# Altium project Generador_de_funciones.PrjPcb
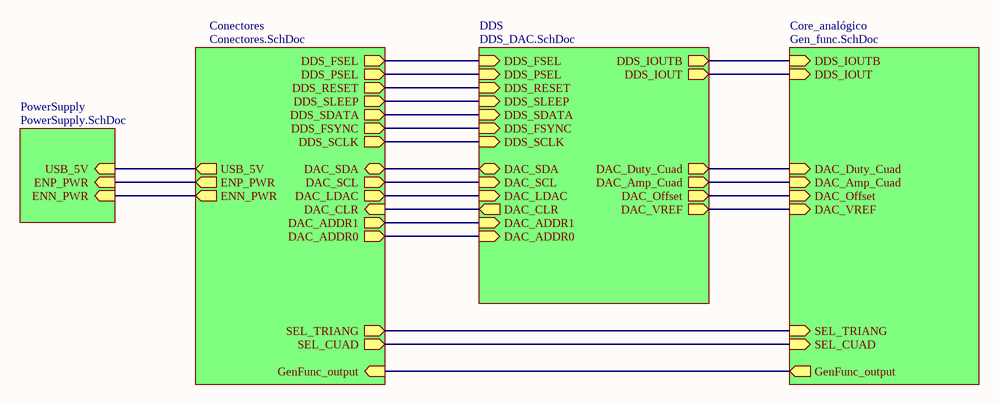
[diagram p0: Top.SchDoc]
5 sheets, 88 parts. Net scope: hierarchical (ports join the sheet entries above them; power ports are global).
Board file: Gen_Func.PcbDoc
Sheets:
  Top.SchDoc
    Conectores = Conectores.SchDoc
    DDS = DDS_DAC.SchDoc
    Core_analógico = Gen_func.SchDoc
    PowerSupply = PowerSupply.SchDoc

## Sheet Top.SchDoc: **
size A4; Author: **; CompanyName: Introducción al Diseño de Circuitos Impresos; Organization: UTN FRBA; Revision: **

### Sub-sheets
Conectores = Conectores.SchDoc: DAC_SDA (bidir), DAC_SCL (out), DAC_LDAC (out), DAC_CLR (in), SEL_CUAD (out), GenFunc_output (in), DDS_FSEL (out), DDS_PSEL (out), DDS_RESET (out), DDS_SLEEP (out), DDS_FSYNC (out), DDS_SDATA (out), DDS_SCLK (out), USB_5V (out), SEL_TRIANG (out), ENN_PWR (out), ENP_PWR (out), DAC_ADDR1 (out), DAC_ADDR0 (out)
Core_analógico = Gen_func.SchDoc: DDS_IOUT (in), DDS_IOUTB (in), DAC_Amp_Cuad (in), SEL_CUAD (in), GenFunc_output (out), DAC_Duty_Cuad (in), SEL_TRIANG (in), DAC_Offset (in), DAC_VREF (in)
DDS = DDS_DAC.SchDoc: DDS_FSEL (in), DDS_PSEL (in), DDS_RESET (in), DDS_SLEEP (in), DDS_SDATA (in), DDS_SCLK (in), DDS_IOUTB (out), DDS_IOUT (out), DDS_FSYNC (in), DAC_SDA (bidir), DAC_SCL (in), DAC_LDAC (in), DAC_CLR (out), DAC_Amp_Cuad (out), DAC_Duty_Cuad (out), DAC_Offset (out), DAC_ADDR0 (in), DAC_ADDR1 (in), DAC_VREF (out)
PowerSupply = PowerSupply.SchDoc: USB_5V (in), ENP_PWR (in), ENN_PWR (in)

### Nets
DAC_Amp_Cuad: sheet DDS/DAC_Amp_Cuad, sheet Core_analógico/DAC_Amp_Cuad
DAC_Duty_Cuad: sheet DDS/DAC_Duty_Cuad, sheet Core_analógico/DAC_Duty_Cuad
DAC_Offset: sheet DDS/DAC_Offset, sheet Core_analógico/DAC_Offset
DAC_Vref: sheet DDS/DAC_VREF, sheet Core_analógico/DAC_VREF
SEL_CUAD: sheet Conectores/SEL_CUAD, sheet Core_analógico/SEL_CUAD
SEL_TRIANG: sheet Conectores/SEL_TRIANG, sheet Core_analógico/SEL_TRIANG
USB_5V: sheet Conectores/USB_5V, sheet PowerSupply/USB_5V
NetC36_1: sheet DDS/DDS_IOUTB, sheet Core_analógico/DDS_IOUTB
NetC36_2: sheet DDS/DDS_IOUT, sheet Core_analógico/DDS_IOUT
NetJ1_1: sheet Conectores/GenFunc_output, sheet Core_analógico/GenFunc_output
NetJ1_9: sheet Conectores/ENP_PWR, sheet PowerSupply/ENP_PWR
NetJ1_10: sheet Conectores/ENN_PWR, sheet PowerSupply/ENN_PWR
NetJ2_1: sheet Conectores/DDS_FSEL, sheet DDS/DDS_FSEL
NetJ2_2: sheet Conectores/DDS_RESET, sheet DDS/DDS_RESET
NetJ2_3: sheet Conectores/DDS_SDATA, sheet DDS/DDS_SDATA
NetJ2_4: sheet Conectores/DDS_FSYNC, sheet DDS/DDS_FSYNC
NetJ2_7: sheet Conectores/DAC_ADDR0, sheet DDS/DAC_ADDR0
NetJ2_8: sheet Conectores/DAC_SDA, sheet DDS/DAC_SDA
NetJ2_9: sheet Conectores/DAC_LDAC, sheet DDS/DAC_LDAC
NetJ2_11: sheet Conectores/DDS_PSEL, sheet DDS/DDS_PSEL
NetJ2_12: sheet Conectores/DDS_SLEEP, sheet DDS/DDS_SLEEP
NetJ2_13: sheet Conectores/DDS_SCLK, sheet DDS/DDS_SCLK
NetJ2_16: sheet Conectores/DAC_ADDR1, sheet DDS/DAC_ADDR1
NetJ2_17: sheet Conectores/DAC_SCL, sheet DDS/DAC_SCL
NetJ2_18: sheet Conectores/DAC_CLR, sheet DDS/DAC_CLR

### Notes on the sheet
- Title:
- Size:
- Author:
- A4
- Sheet
- of
- Revision:
- File:
- Date:

## Sheet Conectores.SchDoc: **
size A4; Author: **; CompanyName: Introducción al Diseño de Circuitos Impresos; Organization: UTN FRBA; Revision: **
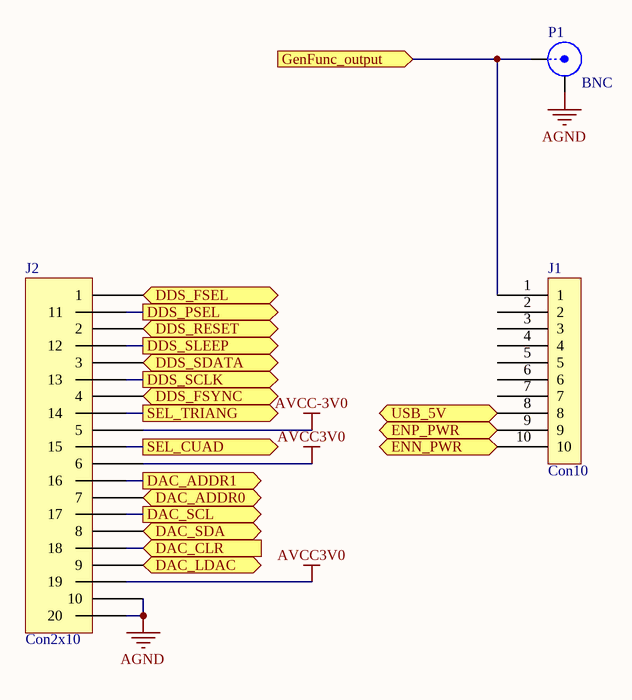
[diagram p1: Conectores.SchDoc]

### Parts
J1  Con10  [Connector .1 x10]
J2  Con2x10  [Con2x10]
P1  BNC  [BNC]

### Ports
DAC_ADDR0 (out), DAC_ADDR1 (out), DAC_CLR (in), DAC_LDAC (out), DAC_SCL (out), DAC_SDA (bidir), DDS_FSEL (out), DDS_FSYNC (out), DDS_PSEL (out), DDS_RESET (out), DDS_SCLK (out), DDS_SDATA (out), DDS_SLEEP (out), ENN_PWR (out), ENP_PWR (out), GenFunc_output (in), SEL_CUAD (out), SEL_TRIANG (out), USB_5V (out)

### Nets
AGND: J2.10 J2.20 P1.2(Y)
AVCC3V0: J2.6 J2.19
AVCC-3V0: J2.5
SEL_CUAD: J2.15 ; port SEL_CUAD
SEL_TRIANG: J2.14 ; port SEL_TRIANG
USB_5V: J1.8 ; port USB_5V
NetJ1_1: J1.1 P1.1(X) ; port GenFunc_output
NetJ1_9: J1.9 ; port ENP_PWR
NetJ1_10: J1.10 ; port ENN_PWR
NetJ2_1: J2.1 ; port DDS_FSEL
NetJ2_2: J2.2 ; port DDS_RESET
NetJ2_3: J2.3 ; port DDS_SDATA
NetJ2_4: J2.4 ; port DDS_FSYNC
NetJ2_7: J2.7 ; port DAC_ADDR0
NetJ2_8: J2.8 ; port DAC_SDA
NetJ2_9: J2.9 ; port DAC_LDAC
NetJ2_11: J2.11 ; port DDS_PSEL
NetJ2_12: J2.12 ; port DDS_SLEEP
NetJ2_13: J2.13 ; port DDS_SCLK
NetJ2_16: J2.16 ; port DAC_ADDR1
NetJ2_17: J2.17 ; port DAC_SCL
NetJ2_18: J2.18 ; port DAC_CLR

Not connected (* = marked no-connect by the designer): J1 2 3 4 5 6 7

### Notes on the sheet
- Title:
- Size:
- Author:
- A4
- Sheet
- of
- Revision:
- File:
- Date:

### Library data of the parts
J1 = Con10: Connector x10
J2 = Con2x10: Connector 2x10
P1 = BNC: BNC Elbow Connector; LatestRevisionDate: 17-Jul-2002; LatestRevisionNote: Re-released for DXP Platform.; Publisher: Altium Limited

## Sheet DDS_DAC.SchDoc: **
size A4; Author: **; CompanyName: Introducción al Diseño de Circuitos Impresos; Organization: UTN FRBA; Revision: **
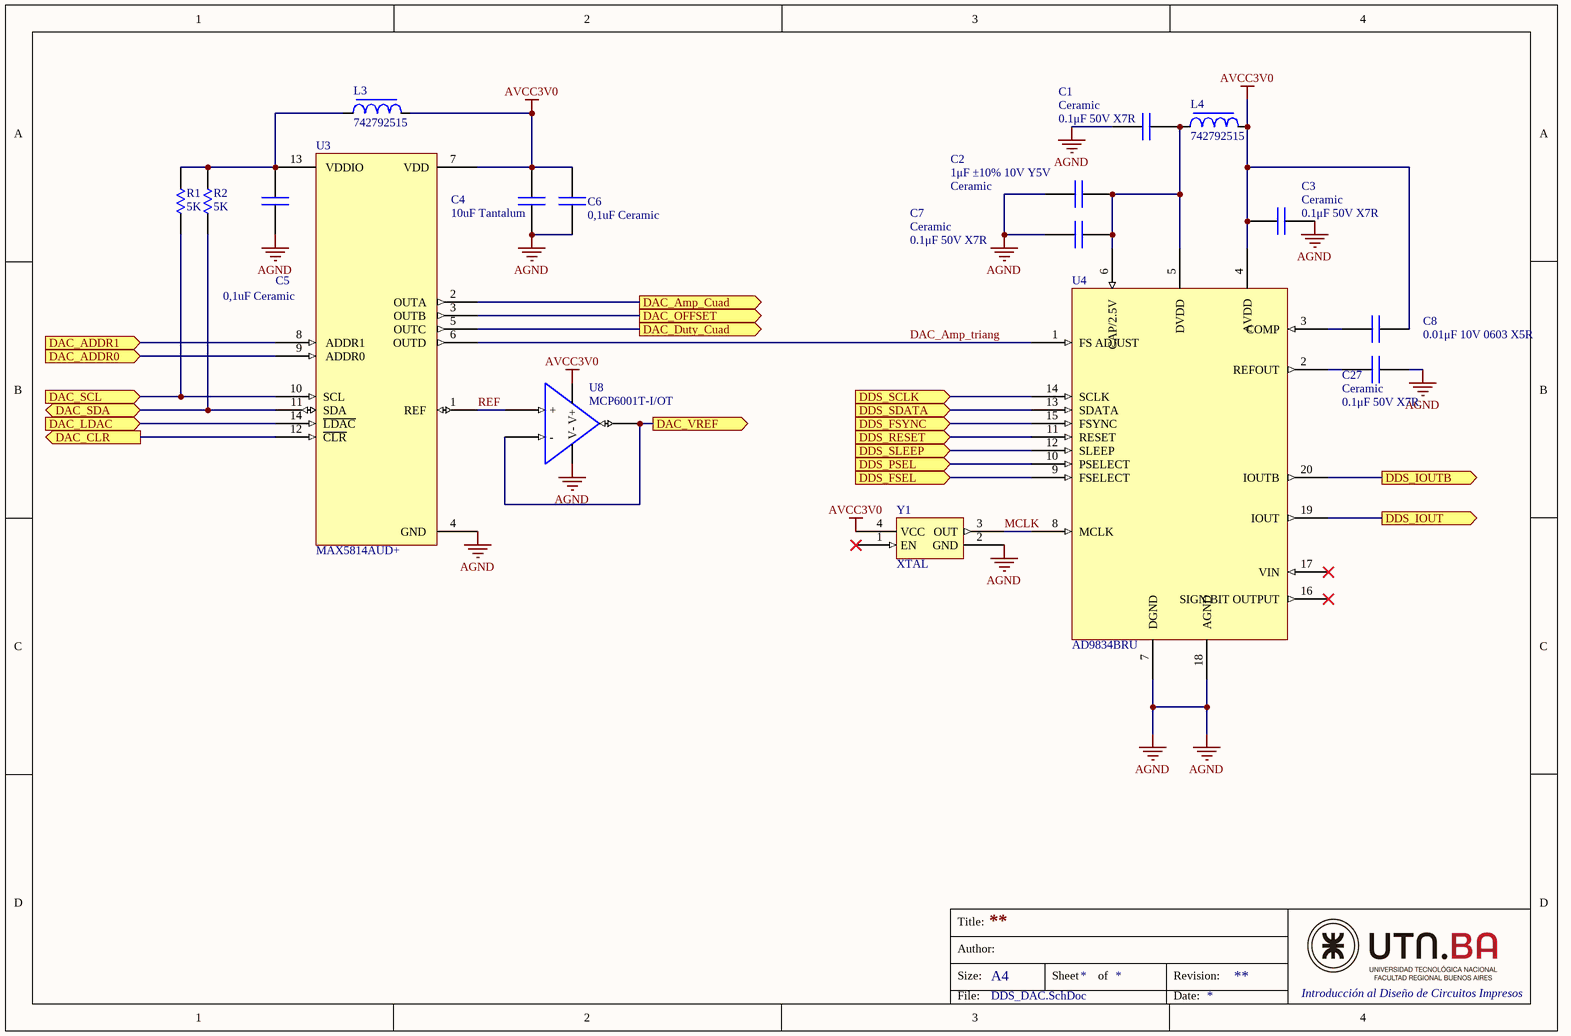
[diagram p2: DDS_DAC.SchDoc]

### Parts
C1  0.1μF 50V X7R  Type: Ceramic  [C_0805]
C2  1μF ±10% 10V Y5V  Type: Ceramic  [C_0805]
C3  0.1μF 50V X7R  Type: Ceramic  [C_0805]
C4  10uF Tantalum  [C_0805]
C5  0,1uF Ceramic  [C_0805]
C6  0,1uF Ceramic  [C_0805]
C7  0.1μF 50V X7R  Type: Ceramic  [C_0805]
C8  0.01μF 10V 0603 X5R  [C_0805]
C27  0.1μF 50V X7R  Type: Ceramic  [C_0805]
L3  742792515  [L_1812]
L4  742792515  [L_1812]
R1  5K  [R_0805]
R2  5K  [R_0805]
U3  MAX5814AUD+
U4  AD9834BRU  [TSSOP_20]
U8  MCP6001T-I/OT  [SOT_23]
Y1  XTAL  [XTAL_4]

### Ports
DAC_ADDR0 (in), DAC_ADDR1 (in), DAC_Amp_Cuad (out), DAC_CLR (out), DAC_Duty_Cuad (out), DAC_LDAC (in), DAC_OFFSET (out), DAC_SCL (in), DAC_SDA (bidir), DAC_VREF (out), DDS_FSEL (in), DDS_FSYNC (in), DDS_IOUT (out), DDS_IOUTB (out), DDS_PSEL (in), DDS_RESET (in), DDS_SCLK (in), DDS_SDATA (in), DDS_SLEEP (in)

### Nets
AGND: C1.1 C2.1 C3.2 C4.2 C5.2 C6.2 C7.1 C27.2 U3.4(GND) U4.7(DGND) U4.18(AGND) U8.2(V-) Y1.2(GND)
AVCC3V0: C3.1 C4.1 C6.1 C8.1 L3.2 L4.2 U3.7(VDD) U4.4(AVDD) U8.5(V+) Y1.4(VCC)
DAC_Amp_Cuad: U3.2(OUTA) ; port DAC_Amp_Cuad
DAC_Amp_triang: U3.6(OUTD) U4.1(FS_ADJUST)
DAC_Duty_Cuad: U3.5(OUTC) ; port DAC_Duty_Cuad
DAC_Offset: U3.3(OUTB) ; port DAC_OFFSET
DAC_Vref: U8.1(Vout) U8.4(-) ; port DAC_VREF
MCLK: U4.8(MCLK) Y1.3(OUT)
REF: U3.1(REF) U8.3(+)
NetC1_2: C1.2 C2.2 C7.2 L4.1 U4.5(DVDD) U4.6(CAP/2.5V)
NetC5_1: C5.1 L3.1 R1.2 R2.2 U3.13(VDDIO)
NetC8_2: C8.2 U4.3(COMP)
NetC27_1: C27.1 U4.2(REFOUT)
NetC36_1: U4.20(IOUTB) ; port DDS_IOUTB
NetC36_2: U4.19(IOUT) ; port DDS_IOUT
NetJ2_1: U4.9(FSELECT) ; port DDS_FSEL
NetJ2_2: U4.11(RESET) ; port DDS_RESET
NetJ2_3: U4.13(SDATA) ; port DDS_SDATA
NetJ2_4: U4.15(FSYNC) ; port DDS_FSYNC
NetJ2_7: U3.9(ADDR0) ; port DAC_ADDR0
NetJ2_8: R2.1 U3.11(SDA) ; port DAC_SDA
NetJ2_9: U3.14(~{LDAC}) ; port DAC_LDAC
NetJ2_11: U4.10(PSELECT) ; port DDS_PSEL
NetJ2_12: U4.12(SLEEP) ; port DDS_SLEEP
NetJ2_13: U4.14(SCLK) ; port DDS_SCLK
NetJ2_16: U3.8(ADDR1) ; port DAC_ADDR1
NetJ2_17: R1.1 U3.10(SCL) ; port DAC_SCL
NetJ2_18: U3.12(~{CLR}) ; port DAC_CLR

Not connected (* = marked no-connect by the designer): U4 16(SIGN_BIT_OUTPUT)* 17(VIN)*; Y1 1(EN)*

### Notes on the sheet
- Title:
- Size:
- Author:
- A4
- Sheet
- of
- Revision:
- File:
- Date:

### Library data of the parts
C1-C8 C27 = Cap: Capacitor
L3 L4 = Ferrite: Ferrite Bead
R1 R2 = Res: Resistor
U3 = DAC_14Leads: DAC x4 I2C
U4 = DDS: DDS 50MHz
U8 = OpAmp
Y1 = XTAL: Crystal oscillator

## Sheet Gen_func.SchDoc: **
size A4; Author: **; CompanyName: Introducción al Diseño de Circuitos Impresos; Organization: UTN FRBA; Revision: **
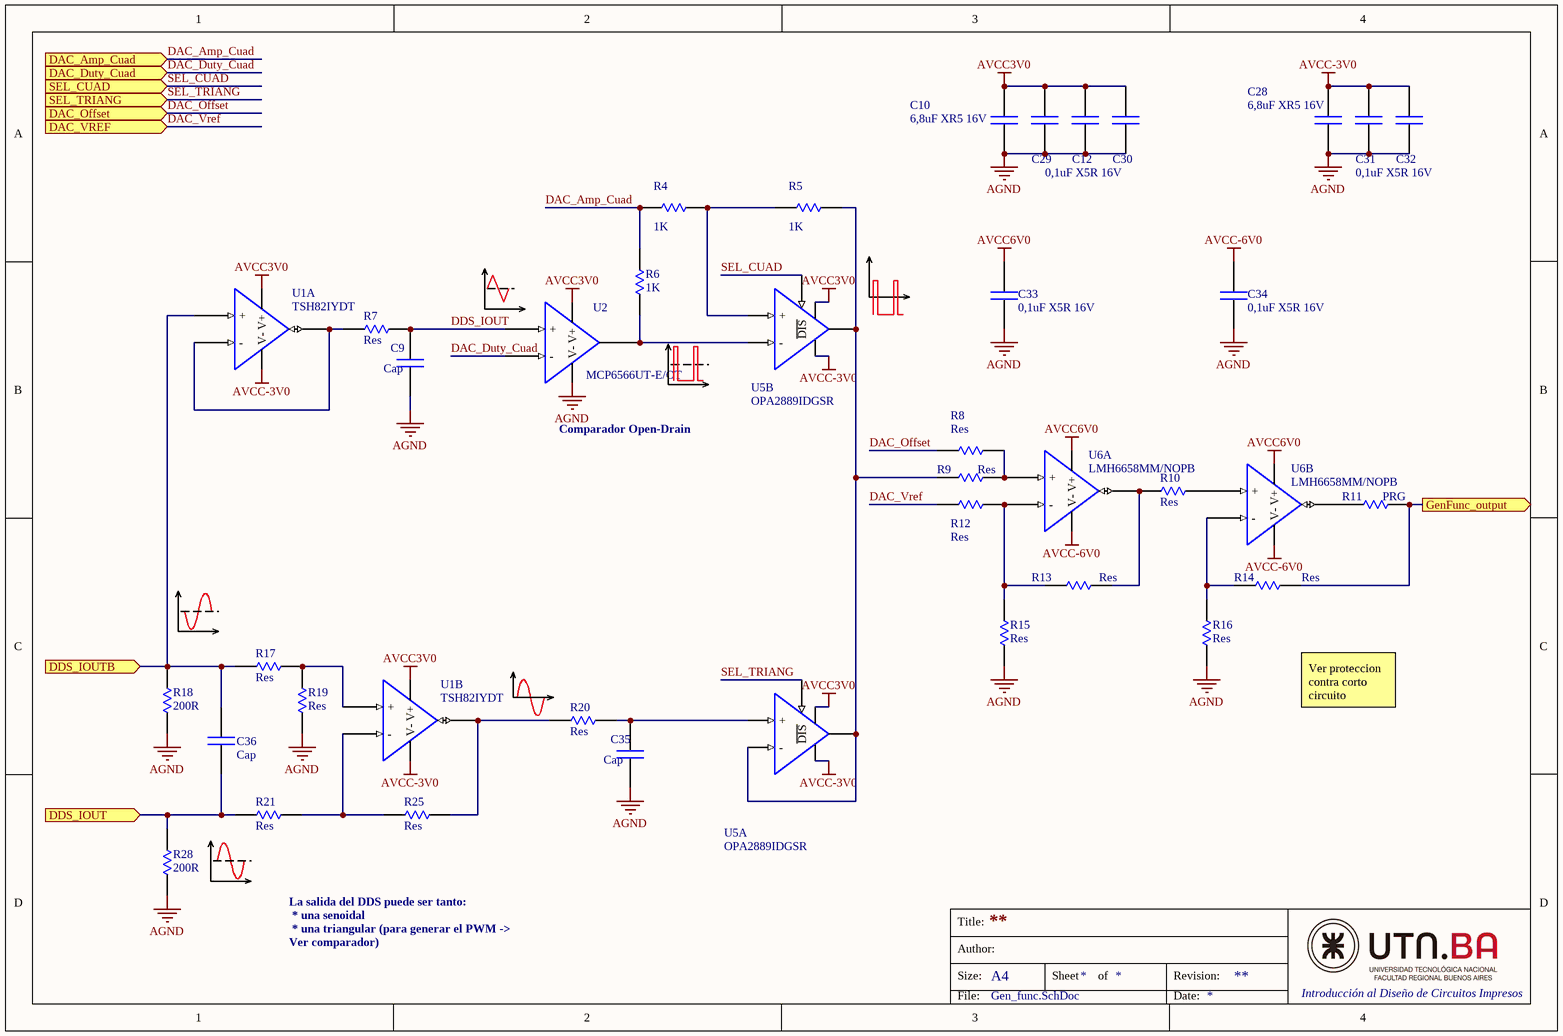
[diagram p3: Gen_func.SchDoc]

### Parts
C9  Cap  [C_0603]
C10  6,8uF XR5 16V  [C_0805]
C12  0,1uF X5R 16V  [C_0603]  (value not drawn)
C28  6,8uF XR5 16V  [C_0805]
C29  0,1uF X5R 16V  [C_0603]
C30  0,1uF X5R 16V  [C_0603]  (value not drawn)
C31  0,1uF X5R 16V  [C_0603]
C32  0,1uF X5R 16V  [C_0603]  (value not drawn)
C33  0,1uF X5R 16V  [C_0603]
C34  0,1uF X5R 16V  [C_0603]
C35  Cap  [C_0603]
C36  Cap  [C_0603]
R4  1K  [R_0603]
R5  1K  [R_0603]
R6  1K  [R_0603]
R7  Res  [R_0603]
R8  Res  [R_0603]
R9  Res  [R_0603]
R10  Res  [R_0603]
R11  PRG  [R_0603]
R12  Res  [R_0603]
R13  Res  [R_0603]
R14  Res  [R_0603]
R15  Res  [R_0603]
R16  Res  [R_0603]
R17  Res  [R_0603]
R18  200R  [R_0603]
R19  Res  [R_0603]
R20  Res  [R_0603]
R21  Res  [R_0603]
R25  Res  [R_0603]
R28  200R  [R_0603]
U1  TSH82IYDT  [SOIC_8]  (parts A,B of 2)
U2  MCP6566UT-E/OT  [SOT_23]
U5  OPA2889IDGSR  [MSOP_10]  (parts A,B of 2)
U6  LMH6658MM/NOPB  [VSSOP_8]  (parts A,B of 2)

### Ports
DAC_Amp_Cuad (in), DAC_Duty_Cuad (in), DAC_Offset (in), DAC_VREF (in), DDS_IOUT (in), DDS_IOUTB (in), GenFunc_output (out), SEL_CUAD (in), SEL_TRIANG (in)

### Nets
AGND: C9.2 C10.2 C12.2 C28.2 C29.2 C30.2 C31.2 C32.2 C33.2 C34.2 C35.2 R15.1 R16.1 R18.1 R19.1 R28.1 U2.2(V-)
AVCC3V0: C10.1 C12.1 C29.1 C30.1 U1.8(V+) U2.5(V+) U5.8(V+)
AVCC6V0: C33.1 U6.8(V+)
AVCC-3V0: C28.1 C31.1 C32.1 U1.4(V-) U5.3(V-)
AVCC-6V0: C34.1 U6.4(V-)
DAC_Amp_Cuad: R4.1 R6.2 ; port DAC_Amp_Cuad
DAC_Duty_Cuad: U2.4(-) ; port DAC_Duty_Cuad
DAC_Offset: R8.1 ; port DAC_Offset
DAC_Vref: R12.1 ; port DAC_VREF
DDS_IOUT: C9.1 R7.2 U2.3(+)
SEL_CUAD: U5.4(~{DIS}) ; port SEL_CUAD
SEL_TRIANG: U5.2(~{DIS}) ; port SEL_TRIANG
NetC35_1: C35.1 R20.1 U5.1(+)
NetC36_1: C36.1 R17.1 R18.2 U1.3(+) ; port DDS_IOUTB
NetC36_2: C36.2 R21.2 R28.2 ; port DDS_IOUT
NetJ1_1: R11.2 R14.2 ; port GenFunc_output
NetR4_2: R4.2 R5.2 U5.5(+)
NetR5_1: R5.1 R9.1 U5.7(Vout) U5.9(Vout) U5.10(-)
NetR6_1: R6.1 U2.1(Vout) U5.6(-)
NetR7_1: R7.1 U1.1(Vout) U1.2(-)
NetR8_2: R8.2 R9.2 U6.3(+)
NetR10_1: R10.1 R13.2 U6.1(Vout)
NetR10_2: R10.2 U6.5(+)
NetR11_1: R11.1 U6.7(Vout)
NetR12_2: R12.2 R13.1 R15.2 U6.2(-)
NetR14_1: R14.1 R16.2 U6.6(-)
NetR17_2: R17.2 R19.2 U1.5(+)
NetR20_2: R20.2 R25.1 U1.7(Vout)
NetR21_1: R21.1 R25.2 U1.6(-)

### Notes on the sheet
- Comparador Open-Drain
- Ver proteccion contra corto circuito
- La salida del DDS puede ser tanto:
  * una senoidal
  * una triangular (para generar el PWM -> Ver comparador)
- Title:
- Size:
- Author:
- A4
- Sheet
- of
- Revision:
- File:
- Date:

### Library data of the parts
C9 C10 C12 C28-C36 = Cap: Capacitor
R4-R21 R25 R28 = Res: Resistor
U1 = OpAmp_x2: Manufacturer: ST
U2 = Comp: Comparator
U5 = OpAmp_Dis: OpAmp_Disable_x2
U6 = OpAmp_x2

## Sheet PowerSupply.SchDoc: **
size A4; Author: **; CompanyName: Introducción al Diseño de Circuitos Impresos; Organization: UTN FRBA; Revision: **
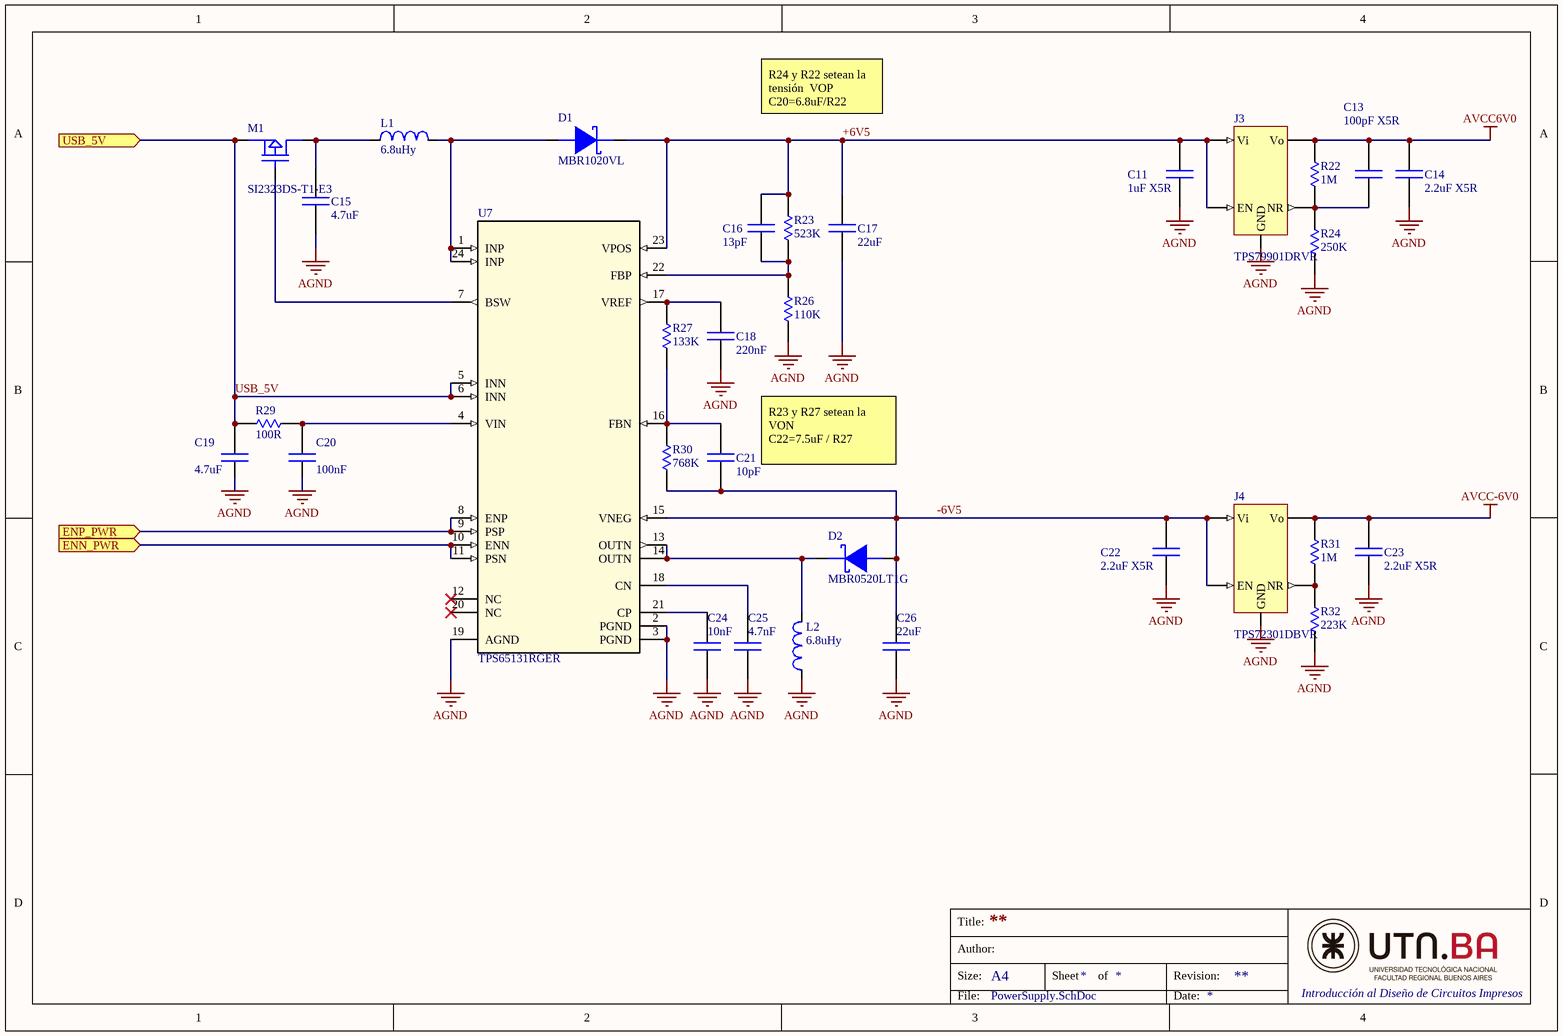
[diagram p4: PowerSupply.SchDoc]

### Parts
C11  1uF X5R  [C_0805]
C13  100pF X5R  [C_0805]
C14  2.2uF X5R  [C_0805]
C15  4.7uF  [C_0805]
C16  13pF  [C_0603]
C17  22uF  [C_1206]
C18  220nF  [C_0603]
C19  4.7uF  [C_0805]
C20  100nF  [C_0603]
C21  10pF  [C_0603]
C22  2.2uF X5R  [C_0805]
C23  2.2uF X5R  [C_0805]
C24  10nF  [C_0603]
C25  4.7nF  [C_0603]
C26  22uF  [C_1206]
D1  MBR1020VL  [SOD-123]
D2  MBR0520LT1G  [SOD-123]
J3  TPS79901DRVR  [WSON]
J4  TPS72301DBVR  [SOT_23]
L1  6.8uHy  [L_4028]
L2  6.8uHy  [L_4028]
M1  SI2323DS-T1-E3  [SOT_23_Q]
R22  1M  [R_0603]
R23  523K  [R_0603]
R24  250K  [R_0603]
R26  110K  [R_0603]
R27  133K  [R_0603]
R29  100R  [R_0603]
R30  768K  [R_0603]
R31  1M  [R_0603]
R32  223K  [R_0603]
U7  TPS65131RGER  [VQFN-N24]

### Ports
ENN_PWR (in), ENP_PWR (in), USB_5V (in)

### Nets
AGND: C11.2 C14.2 C15.2 C17.1 C18.2 C19.2 C20.2 C22.2 C23.2 C24.2 C25.2 C26.2 J3.2(GND) J4.2(GND) L2.1 R24.1 R26.2 R32.1 U7.2(PGND) U7.3(PGND) U7.19(AGND)
AVCC6V0: C13.1 C14.1 J3.5(Vo) R22.2
AVCC-6V0: C23.1 J4.5(Vo) R31.2
+6V5: C11.1 C16.2 C17.2 D1.1(K) J3.1(Vi) J3.3(EN) R23.1 U7.23(VPOS)
-6V5: C21.1 C22.1 C26.1 D2.2(A) J4.1(Vi) J4.3(EN) R30.2 U7.15(VNEG)
USB_5V: C19.1 M1.2(Source) R29.1 U7.5(INN) U7.6(INN) ; port USB_5V
NetC13_2: C13.2 J3.4(NR) R22.1 R24.2
NetC15_1: C15.1 L1.1 M1.3(Drain)
NetC16_1: C16.1 R23.2 R26.1 U7.22(FBP)
NetC18_1: C18.1 R27.2 U7.17(VREF)
NetC20_1: C20.1 R29.2 U7.4(VIN)
NetC21_2: C21.2 R27.1 R30.1 U7.16(FBN)
NetC24_1: C24.1 U7.21(CP)
NetC25_1: C25.1 U7.18(CN)
NetD1_2: D1.2(A) L1.2 U7.1(INP) U7.24(INP)
NetD2_1: D2.1(K) L2.2 U7.13(OUTN) U7.14(OUTN)
NetJ1_9: U7.8(ENP) U7.9(PSP) ; port ENP_PWR
NetJ1_10: U7.10(ENN) U7.11(PSN) ; port ENN_PWR
NetJ4_4: J4.4(NR) R31.1 R32.2
NetM1_1: M1.1(Gate) U7.7(BSW)

Not connected (* = marked no-connect by the designer): U7 12(NC)* 20(NC)*

### Notes on the sheet
- R24 y R22 setean la tensión  VOP
  C20=6.8uF/R22
- (near C21) R23 y R27 setean la VON
  C22=7.5uF / R27
- Title:
- Size:
- Author:
- A4
- Sheet
- of
- Revision:
- File:
- Date:

### Library data of the parts
C11 C13-C26 = Cap: Capacitor
D1 D2 = Diode: Schottky diode; Value: 385mV
J3 J4 = LDO: LDO_Adjustable
L1 L2 = Ind: Inductor
M1 = PMOS: Transistor
R22-R24 R26 R27 R29-R32 = Res: Resistor
U7 = TPS65131RGER: Positive and Negative Output DC-DC Converter; Application_BuildNumber: *

## Nets that join several sheets
AGND: Conectores (J2.10 J2.20 P1.2), DDS_DAC (13 pins), Gen_func (17 pins), PowerSupply (21 pins)
AVCC3V0: Conectores (J2.6 J2.19), DDS_DAC (10 pins), Gen_func (7 pins)
AVCC6V0: Gen_func (C33.1 U6.8), PowerSupply (C13.1 C14.1 J3.5 R22.2)
AVCC-3V0: Conectores (J2.5), Gen_func (5 pins)
AVCC-6V0: Gen_func (C34.1 U6.4), PowerSupply (C23.1 J4.5 R31.2)
DAC_Amp_Cuad: DDS_DAC (U3.2), Gen_func (R4.1 R6.2)
DAC_Duty_Cuad: DDS_DAC (U3.5), Gen_func (U2.4)
DAC_Offset: DDS_DAC (U3.3), Gen_func (R8.1)
DAC_Vref: DDS_DAC (U8.1 U8.4), Gen_func (R12.1)
NetC36_1: DDS_DAC (U4.20), Gen_func (C36.1 R17.1 R18.2 U1.3)
NetC36_2: DDS_DAC (U4.19), Gen_func (C36.2 R21.2 R28.2)
NetJ1_1: Conectores (J1.1 P1.1), Gen_func (R11.2 R14.2)
NetJ1_9: Conectores (J1.9), PowerSupply (U7.8 U7.9)
NetJ1_10: Conectores (J1.10), PowerSupply (U7.10 U7.11)
NetJ2_1: Conectores (J2.1), DDS_DAC (U4.9)
NetJ2_2: Conectores (J2.2), DDS_DAC (U4.11)
NetJ2_3: Conectores (J2.3), DDS_DAC (U4.13)
NetJ2_4: Conectores (J2.4), DDS_DAC (U4.15)
NetJ2_7: Conectores (J2.7), DDS_DAC (U3.9)
NetJ2_8: Conectores (J2.8), DDS_DAC (R2.1 U3.11)
NetJ2_9: Conectores (J2.9), DDS_DAC (U3.14)
NetJ2_11: Conectores (J2.11), DDS_DAC (U4.10)
NetJ2_12: Conectores (J2.12), DDS_DAC (U4.12)
NetJ2_13: Conectores (J2.13), DDS_DAC (U4.14)
NetJ2_16: Conectores (J2.16), DDS_DAC (U3.8)
NetJ2_17: Conectores (J2.17), DDS_DAC (R1.1 U3.10)
NetJ2_18: Conectores (J2.18), DDS_DAC (U3.12)
SEL_CUAD: Conectores (J2.15), Gen_func (U5.4)
SEL_TRIANG: Conectores (J2.14), Gen_func (U5.2)
USB_5V: Conectores (J1.8), PowerSupply (5 pins)